# Altium schematic sheet top.SchDoc
size D; SheetNumber: 1; SheetTotal: 6
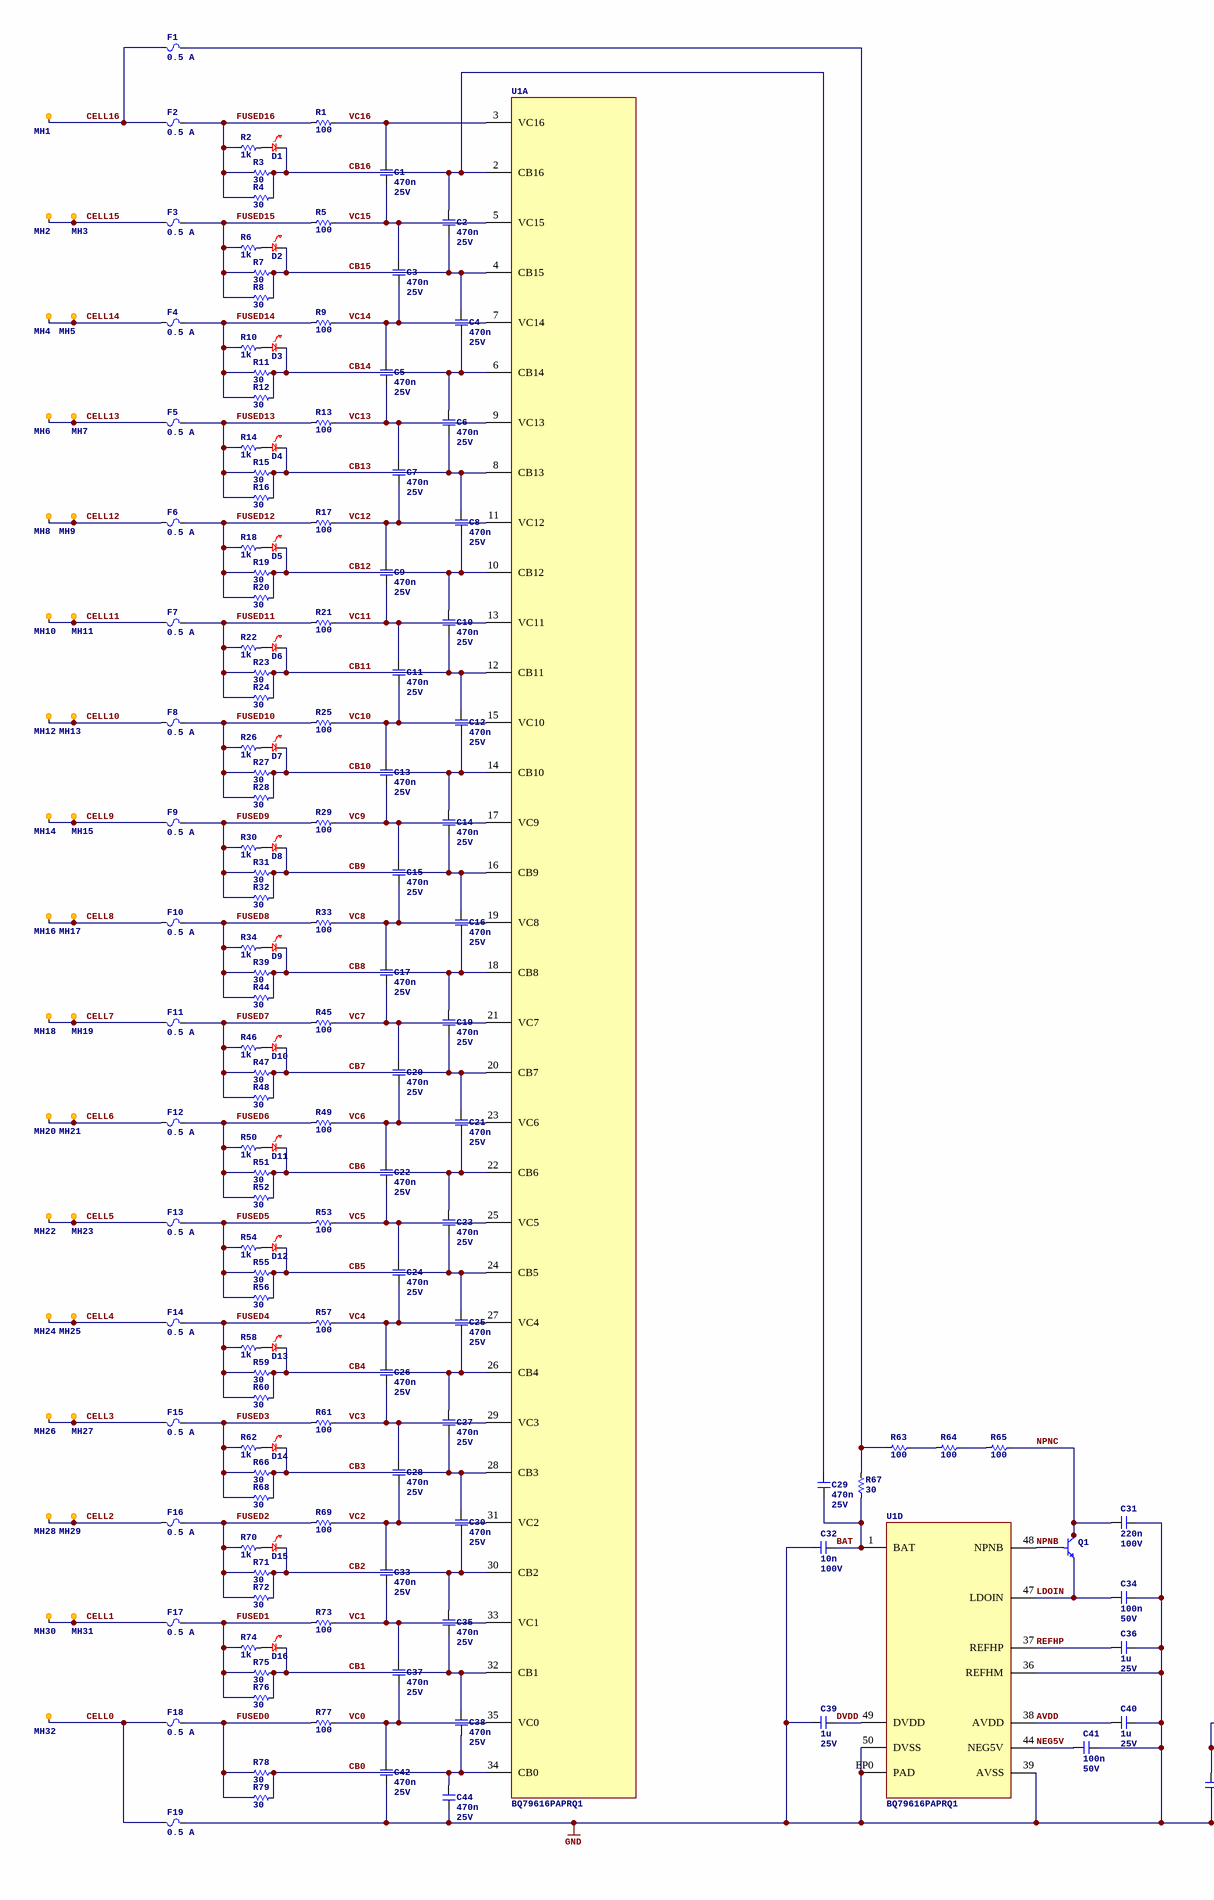
[diagram p0: top.SchDoc, left]
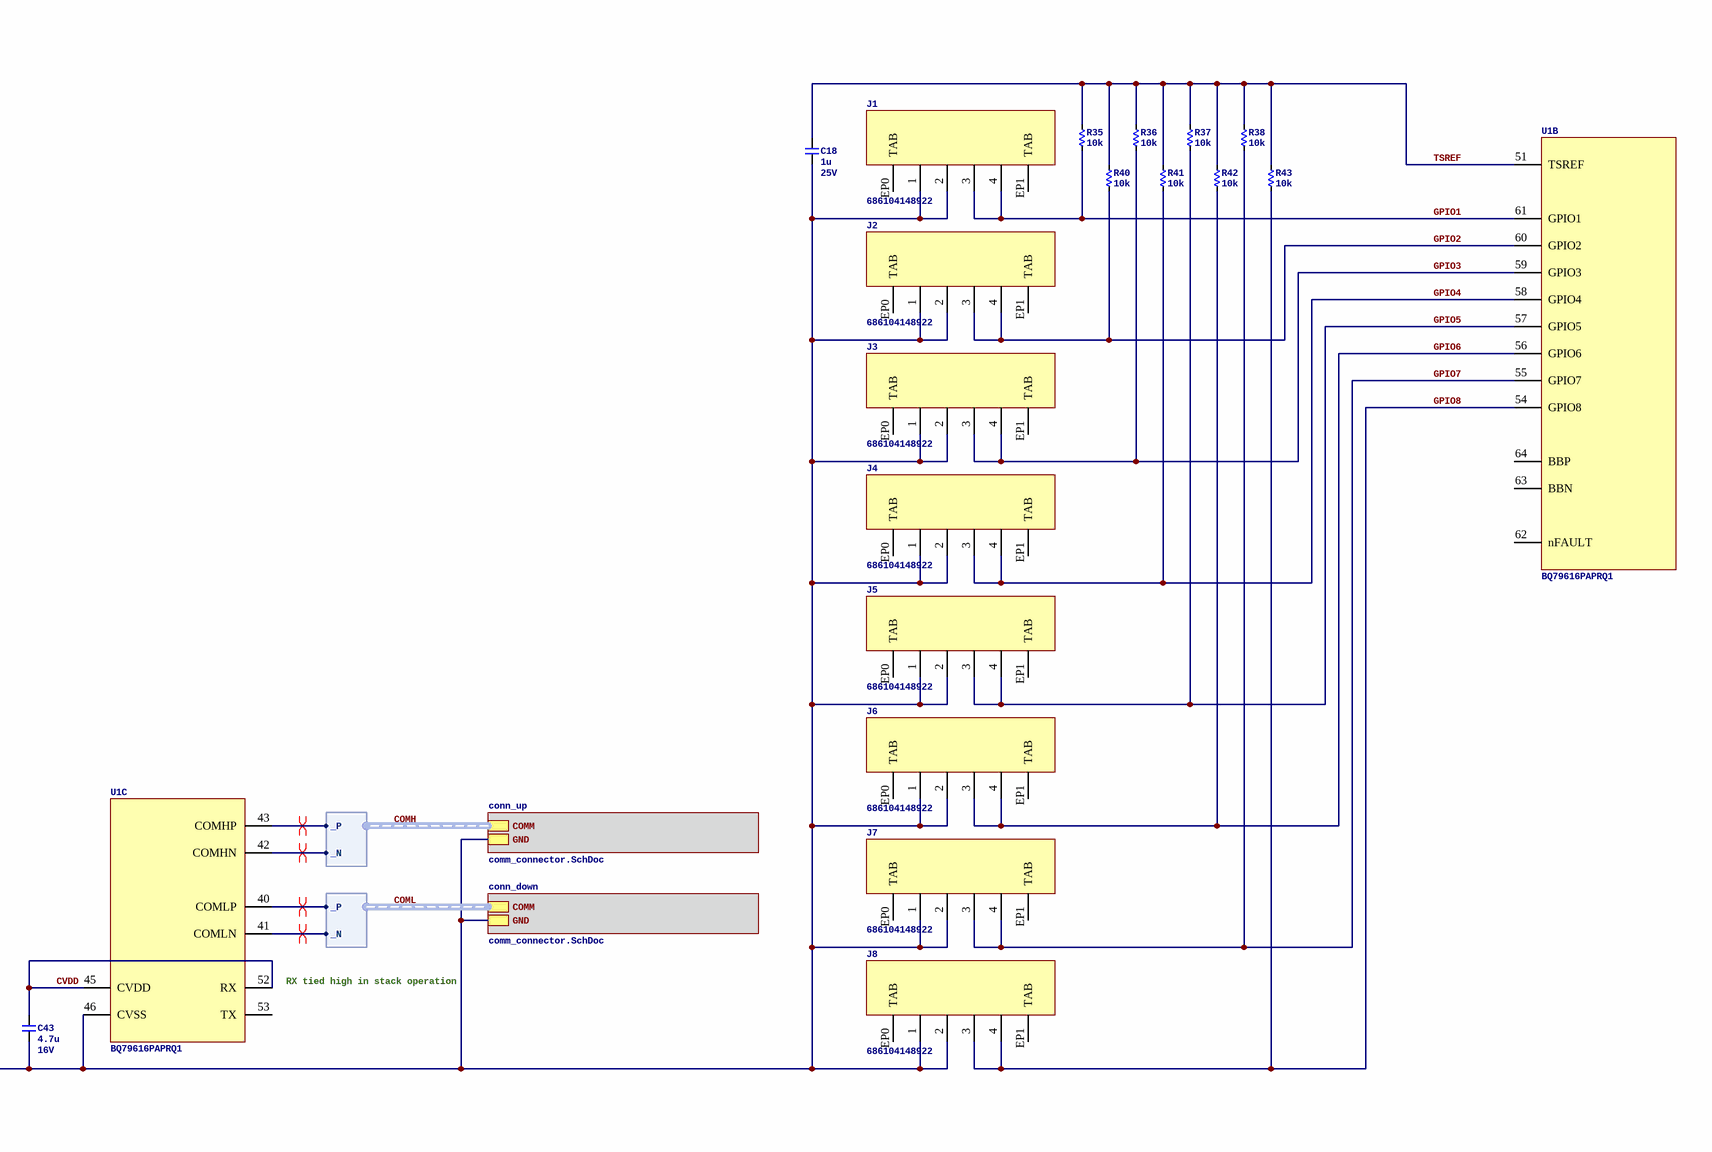
[diagram p1: top.SchDoc, right]

## Parts
C1  Capacitance: 470n  Voltage Rating: 25V  [C0603]  (hidden comment: CL10B474KA8NNNC)
C2  Capacitance: 470n  Voltage Rating: 25V  [C0603]  (hidden comment: CL10B474KA8NNNC)
C3  Capacitance: 470n  Voltage Rating: 25V  [C0603]  (hidden comment: CL10B474KA8NNNC)
C4  Capacitance: 470n  Voltage Rating: 25V  [C0603]  (hidden comment: CL10B474KA8NNNC)
C5  Capacitance: 470n  Voltage Rating: 25V  [C0603]  (hidden comment: CL10B474KA8NNNC)
C6  Capacitance: 470n  Voltage Rating: 25V  [C0603]  (hidden comment: CL10B474KA8NNNC)
C7  Capacitance: 470n  Voltage Rating: 25V  [C0603]  (hidden comment: CL10B474KA8NNNC)
C8  Capacitance: 470n  Voltage Rating: 25V  [C0603]  (hidden comment: CL10B474KA8NNNC)
C9  Capacitance: 470n  Voltage Rating: 25V  [C0603]  (hidden comment: CL10B474KA8NNNC)
C10  Capacitance: 470n  Voltage Rating: 25V  [C0603]  (hidden comment: CL10B474KA8NNNC)
C11  Capacitance: 470n  Voltage Rating: 25V  [C0603]  (hidden comment: CL10B474KA8NNNC)
C12  Capacitance: 470n  Voltage Rating: 25V  [C0603]  (hidden comment: CL10B474KA8NNNC)
C13  Capacitance: 470n  Voltage Rating: 25V  [C0603]  (hidden comment: CL10B474KA8NNNC)
C14  Capacitance: 470n  Voltage Rating: 25V  [C0603]  (hidden comment: CL10B474KA8NNNC)
C15  Capacitance: 470n  Voltage Rating: 25V  [C0603]  (hidden comment: CL10B474KA8NNNC)
C16  Capacitance: 470n  Voltage Rating: 25V  [C0603]  (hidden comment: CL10B474KA8NNNC)
C17  Capacitance: 470n  Voltage Rating: 25V  [C0603]  (hidden comment: CL10B474KA8NNNC)
C18  Capacitance: 1u  Voltage Rating: 25V  [C0603]  (hidden comment: CL10B105KA8NNNC)
C19  Capacitance: 470n  Voltage Rating: 25V  [C0603]  (hidden comment: CL10B474KA8NNNC)
C20  Capacitance: 470n  Voltage Rating: 25V  [C0603]  (hidden comment: CL10B474KA8NNNC)
C21  Capacitance: 470n  Voltage Rating: 25V  [C0603]  (hidden comment: CL10B474KA8NNNC)
C22  Capacitance: 470n  Voltage Rating: 25V  [C0603]  (hidden comment: CL10B474KA8NNNC)
C23  Capacitance: 470n  Voltage Rating: 25V  [C0603]  (hidden comment: CL10B474KA8NNNC)
C24  Capacitance: 470n  Voltage Rating: 25V  [C0603]  (hidden comment: CL10B474KA8NNNC)
C25  Capacitance: 470n  Voltage Rating: 25V  [C0603]  (hidden comment: CL10B474KA8NNNC)
C26  Capacitance: 470n  Voltage Rating: 25V  [C0603]  (hidden comment: CL10B474KA8NNNC)
C27  Capacitance: 470n  Voltage Rating: 25V  [C0603]  (hidden comment: CL10B474KA8NNNC)
C28  Capacitance: 470n  Voltage Rating: 25V  [C0603]  (hidden comment: CL10B474KA8NNNC)
C29  Capacitance: 470n  Voltage Rating: 25V  [C0603]  (hidden comment: CL10B474KA8NNNC)
C30  Capacitance: 470n  Voltage Rating: 25V  [C0603]  (hidden comment: CL10B474KA8NNNC)
C31  Capacitance: 220n  Voltage Rating: 100V  [C1206]  (hidden comment: TCC1206X7R224K101FT)
C32  Capacitance: 10n  Voltage Rating: 100V  [C0402]  (hidden comment: CC0402KRX7R0BB103)
C33  Capacitance: 470n  Voltage Rating: 25V  [C0603]  (hidden comment: CL10B474KA8NNNC)
C34  Capacitance: 100n  Voltage Rating: 50V  [C0402]  (hidden comment: CL05B104KB54PNC)
C35  Capacitance: 470n  Voltage Rating: 25V  [C0603]  (hidden comment: CL10B474KA8NNNC)
C36  Capacitance: 1u  Voltage Rating: 25V  [C0603]  (hidden comment: CL10B105KA8NNNC)
C37  Capacitance: 470n  Voltage Rating: 25V  [C0603]  (hidden comment: CL10B474KA8NNNC)
C38  Capacitance: 470n  Voltage Rating: 25V  [C0603]  (hidden comment: CL10B474KA8NNNC)
C39  Capacitance: 1u  Voltage Rating: 25V  [C0603]  (hidden comment: CL10B105KA8NNNC)
C40  Capacitance: 1u  Voltage Rating: 25V  [C0603]  (hidden comment: CL10B105KA8NNNC)
C41  Capacitance: 100n  Voltage Rating: 50V  [C0402]  (hidden comment: CL05B104KB54PNC)
C42  Capacitance: 470n  Voltage Rating: 25V  [C0603]  (hidden comment: CL10B474KA8NNNC)
C43  Capacitance: 4.7u  Voltage Rating: 16V  [C0805]  (hidden comment: CL21B475KOFNNNE)
C44  Capacitance: 470n  Voltage Rating: 25V  [C0603]  (hidden comment: CL10B474KA8NNNC)
D1  LTST-C190KRKT  [LED_0603P_RED]  (value not drawn)
D2  LTST-C190KRKT  [LED_0603P_RED]  (value not drawn)
D3  LTST-C190KRKT  [LED_0603P_RED]  (value not drawn)
D4  LTST-C190KRKT  [LED_0603P_RED]  (value not drawn)
D5  LTST-C190KRKT  [LED_0603P_RED]  (value not drawn)
D6  LTST-C190KRKT  [LED_0603P_RED]  (value not drawn)
D7  LTST-C190KRKT  [LED_0603P_RED]  (value not drawn)
D8  LTST-C190KRKT  [LED_0603P_RED]  (value not drawn)
D9  LTST-C190KRKT  [LED_0603P_RED]  (value not drawn)
D10  LTST-C190KRKT  [LED_0603P_RED]  (value not drawn)
D11  LTST-C190KRKT  [LED_0603P_RED]  (value not drawn)
D12  LTST-C190KRKT  [LED_0603P_RED]  (value not drawn)
D13  LTST-C190KRKT  [LED_0603P_RED]  (value not drawn)
D14  LTST-C190KRKT  [LED_0603P_RED]  (value not drawn)
D15  LTST-C190KRKT  [LED_0603P_RED]  (value not drawn)
D16  LTST-C190KRKT  [LED_0603P_RED]  (value not drawn)
F1  Current: 0.5 A  [JDTFUSE_JFC2410]  (hidden comment: JFC2410-0500TS)
F2  Current: 0.5 A  [JDTFUSE_JFC2410]  (hidden comment: JFC2410-0500TS)
F3  Current: 0.5 A  [JDTFUSE_JFC2410]  (hidden comment: JFC2410-0500TS)
F4  Current: 0.5 A  [JDTFUSE_JFC2410]  (hidden comment: JFC2410-0500TS)
F5  Current: 0.5 A  [JDTFUSE_JFC2410]  (hidden comment: JFC2410-0500TS)
F6  Current: 0.5 A  [JDTFUSE_JFC2410]  (hidden comment: JFC2410-0500TS)
F7  Current: 0.5 A  [JDTFUSE_JFC2410]  (hidden comment: JFC2410-0500TS)
F8  Current: 0.5 A  [JDTFUSE_JFC2410]  (hidden comment: JFC2410-0500TS)
F9  Current: 0.5 A  [JDTFUSE_JFC2410]  (hidden comment: JFC2410-0500TS)
F10  Current: 0.5 A  [JDTFUSE_JFC2410]  (hidden comment: JFC2410-0500TS)
F11  Current: 0.5 A  [JDTFUSE_JFC2410]  (hidden comment: JFC2410-0500TS)
F12  Current: 0.5 A  [JDTFUSE_JFC2410]  (hidden comment: JFC2410-0500TS)
F13  Current: 0.5 A  [JDTFUSE_JFC2410]  (hidden comment: JFC2410-0500TS)
F14  Current: 0.5 A  [JDTFUSE_JFC2410]  (hidden comment: JFC2410-0500TS)
F15  Current: 0.5 A  [JDTFUSE_JFC2410]  (hidden comment: JFC2410-0500TS)
F16  Current: 0.5 A  [JDTFUSE_JFC2410]  (hidden comment: JFC2410-0500TS)
F17  Current: 0.5 A  [JDTFUSE_JFC2410]  (hidden comment: JFC2410-0500TS)
F18  Current: 0.5 A  [JDTFUSE_JFC2410]  (hidden comment: JFC2410-0500TS)
F19  Current: 0.5 A  [JDTFUSE_JFC2410]  (hidden comment: JFC2410-0500TS)
J1  686104148922  [WURTH_WR-FPC_1.00mm_686104148922]
J2  686104148922  [WURTH_WR-FPC_1.00mm_686104148922]
J3  686104148922  [WURTH_WR-FPC_1.00mm_686104148922]
J4  686104148922  [WURTH_WR-FPC_1.00mm_686104148922]
J5  686104148922  [WURTH_WR-FPC_1.00mm_686104148922]
J6  686104148922  [WURTH_WR-FPC_1.00mm_686104148922]
J7  686104148922  [WURTH_WR-FPC_1.00mm_686104148922]
J8  686104148922  [WURTH_WR-FPC_1.00mm_686104148922]
MH1  HOLE  [HOLE_M2]  (value not drawn)  (no BOM)
MH2  HOLE  [HOLE_M2]  (value not drawn)  (no BOM)
MH3  HOLE  [HOLE_M2]  (value not drawn)  (no BOM)
MH4  HOLE  [HOLE_M2]  (value not drawn)  (no BOM)
MH5  HOLE  [HOLE_M2]  (value not drawn)  (no BOM)
MH6  HOLE  [HOLE_M2]  (value not drawn)  (no BOM)
MH7  HOLE  [HOLE_M2]  (value not drawn)  (no BOM)
MH8  HOLE  [HOLE_M2]  (value not drawn)  (no BOM)
MH9  HOLE  [HOLE_M2]  (value not drawn)  (no BOM)
MH10  HOLE  [HOLE_M2]  (value not drawn)  (no BOM)
MH11  HOLE  [HOLE_M2]  (value not drawn)  (no BOM)
MH12  HOLE  [HOLE_M2]  (value not drawn)  (no BOM)
MH13  HOLE  [HOLE_M2]  (value not drawn)  (no BOM)
MH14  HOLE  [HOLE_M2]  (value not drawn)  (no BOM)
MH15  HOLE  [HOLE_M2]  (value not drawn)  (no BOM)
MH16  HOLE  [HOLE_M2]  (value not drawn)  (no BOM)
MH17  HOLE  [HOLE_M2]  (value not drawn)  (no BOM)
MH18  HOLE  [HOLE_M2]  (value not drawn)  (no BOM)
MH19  HOLE  [HOLE_M2]  (value not drawn)  (no BOM)
MH20  HOLE  [HOLE_M2]  (value not drawn)  (no BOM)
MH21  HOLE  [HOLE_M2]  (value not drawn)  (no BOM)
MH22  HOLE  [HOLE_M2]  (value not drawn)  (no BOM)
MH23  HOLE  [HOLE_M2]  (value not drawn)  (no BOM)
MH24  HOLE  [HOLE_M2]  (value not drawn)  (no BOM)
MH25  HOLE  [HOLE_M2]  (value not drawn)  (no BOM)
MH26  HOLE  [HOLE_M2]  (value not drawn)  (no BOM)
MH27  HOLE  [HOLE_M2]  (value not drawn)  (no BOM)
MH28  HOLE  [HOLE_M2]  (value not drawn)  (no BOM)
MH29  HOLE  [HOLE_M2]  (value not drawn)  (no BOM)
MH30  HOLE  [HOLE_M2]  (value not drawn)  (no BOM)
MH31  HOLE  [HOLE_M2]  (value not drawn)  (no BOM)
MH32  HOLE  [HOLE_M2]  (value not drawn)  (no BOM)
Q1  NSV1C201MZ4T1G  [4SOT223]  (value not drawn)
R1  value 100  [R0402]  (hidden comment: RC0402FR-07100RL)
R2  value 1k  [R0402]  (hidden comment: 0402WGF1001TCE)
R3  value 30  [R2512]  (hidden comment: RC2512FK-0730RL)
R4  value 30  [R2512]  (hidden comment: RC2512FK-0730RL)
R5  value 100  [R0402]  (hidden comment: RC0402FR-07100RL)
R6  value 1k  [R0402]  (hidden comment: 0402WGF1001TCE)
R7  value 30  [R2512]  (hidden comment: RC2512FK-0730RL)
R8  value 30  [R2512]  (hidden comment: RC2512FK-0730RL)
R9  value 100  [R0402]  (hidden comment: RC0402FR-07100RL)
R10  value 1k  [R0402]  (hidden comment: 0402WGF1001TCE)
R11  value 30  [R2512]  (hidden comment: RC2512FK-0730RL)
R12  value 30  [R2512]  (hidden comment: RC2512FK-0730RL)
R13  value 100  [R0402]  (hidden comment: RC0402FR-07100RL)
R14  value 1k  [R0402]  (hidden comment: 0402WGF1001TCE)
R15  value 30  [R2512]  (hidden comment: RC2512FK-0730RL)
R16  value 30  [R2512]  (hidden comment: RC2512FK-0730RL)
R17  value 100  [R0402]  (hidden comment: RC0402FR-07100RL)
R18  value 1k  [R0402]  (hidden comment: 0402WGF1001TCE)
R19  value 30  [R2512]  (hidden comment: RC2512FK-0730RL)
R20  value 30  [R2512]  (hidden comment: RC2512FK-0730RL)
R21  value 100  [R0402]  (hidden comment: RC0402FR-07100RL)
R22  value 1k  [R0402]  (hidden comment: 0402WGF1001TCE)
R23  value 30  [R2512]  (hidden comment: RC2512FK-0730RL)
R24  value 30  [R2512]  (hidden comment: RC2512FK-0730RL)
R25  value 100  [R0402]  (hidden comment: RC0402FR-07100RL)
R26  value 1k  [R0402]  (hidden comment: 0402WGF1001TCE)
R27  value 30  [R2512]  (hidden comment: RC2512FK-0730RL)
R28  value 30  [R2512]  (hidden comment: RC2512FK-0730RL)
R29  value 100  [R0402]  (hidden comment: RC0402FR-07100RL)
R30  value 1k  [R0402]  (hidden comment: 0402WGF1001TCE)
R31  value 30  [R2512]  (hidden comment: RC2512FK-0730RL)
R32  value 30  [R2512]  (hidden comment: RC2512FK-0730RL)
R33  value 100  [R0402]  (hidden comment: RC0402FR-07100RL)
R34  value 1k  [R0402]  (hidden comment: 0402WGF1001TCE)
R35  value 10k  [R0402]  (hidden comment: 0402WGF1002TCE)
R36  value 10k  [R0402]  (hidden comment: 0402WGF1002TCE)
R37  value 10k  [R0402]  (hidden comment: 0402WGF1002TCE)
R38  value 10k  [R0402]  (hidden comment: 0402WGF1002TCE)
R39  value 30  [R2512]  (hidden comment: RC2512FK-0730RL)
R40  value 10k  [R0402]  (hidden comment: 0402WGF1002TCE)
R41  value 10k  [R0402]  (hidden comment: 0402WGF1002TCE)
R42  value 10k  [R0402]  (hidden comment: 0402WGF1002TCE)
R43  value 10k  [R0402]  (hidden comment: 0402WGF1002TCE)
R44  value 30  [R2512]  (hidden comment: RC2512FK-0730RL)
R45  value 100  [R0402]  (hidden comment: RC0402FR-07100RL)
R46  value 1k  [R0402]  (hidden comment: 0402WGF1001TCE)
R47  value 30  [R2512]  (hidden comment: RC2512FK-0730RL)
R48  value 30  [R2512]  (hidden comment: RC2512FK-0730RL)
R49  value 100  [R0402]  (hidden comment: RC0402FR-07100RL)
R50  value 1k  [R0402]  (hidden comment: 0402WGF1001TCE)
R51  value 30  [R2512]  (hidden comment: RC2512FK-0730RL)
R52  value 30  [R2512]  (hidden comment: RC2512FK-0730RL)
R53  value 100  [R0402]  (hidden comment: RC0402FR-07100RL)
R54  value 1k  [R0402]  (hidden comment: 0402WGF1001TCE)
R55  value 30  [R2512]  (hidden comment: RC2512FK-0730RL)
R56  value 30  [R2512]  (hidden comment: RC2512FK-0730RL)
R57  value 100  [R0402]  (hidden comment: RC0402FR-07100RL)
R58  value 1k  [R0402]  (hidden comment: 0402WGF1001TCE)
R59  value 30  [R2512]  (hidden comment: RC2512FK-0730RL)
R60  value 30  [R2512]  (hidden comment: RC2512FK-0730RL)
R61  value 100  [R0402]  (hidden comment: RC0402FR-07100RL)
R62  value 1k  [R0402]  (hidden comment: 0402WGF1001TCE)
R63  value 100  [R0402]  (hidden comment: RC0402FR-07100RL)
R64  value 100  [R0402]  (hidden comment: RC0402FR-07100RL)
R65  value 100  [R0402]  (hidden comment: RC0402FR-07100RL)
R66  value 30  [R2512]  (hidden comment: RC2512FK-0730RL)
R67  value 30  [R0402]  (hidden comment: RC0402FR-0730RL)
R68  value 30  [R2512]  (hidden comment: RC2512FK-0730RL)
R69  value 100  [R0402]  (hidden comment: RC0402FR-07100RL)
R70  value 1k  [R0402]  (hidden comment: 0402WGF1001TCE)
R71  value 30  [R2512]  (hidden comment: RC2512FK-0730RL)
R72  value 30  [R2512]  (hidden comment: RC2512FK-0730RL)
R73  value 100  [R0402]  (hidden comment: RC0402FR-07100RL)
R74  value 1k  [R0402]  (hidden comment: 0402WGF1001TCE)
R75  value 30  [R2512]  (hidden comment: RC2512FK-0730RL)
R76  value 30  [R2512]  (hidden comment: RC2512FK-0730RL)
R77  value 100  [R0402]  (hidden comment: RC0402FR-07100RL)
R78  value 30  [R2512]  (hidden comment: RC2512FK-0730RL)
R79  value 30  [R2512]  (hidden comment: RC2512FK-0730RL)
U1  BQ79616PAPRQ1  [TI_PAP0064F]  (parts A,B,C,D of 4)

## Sub-sheets
conn_down = comm_connector.SchDoc: COMM (harness DIFF), GND
conn_up = comm_connector.SchDoc: COMM (harness DIFF), GND

## Harnesses
DIFF: _P, _N

## Nets
GND: C18.2 C31.2 C32.2 C34.2 C36.2 C39.2 C40.2 C41.2 C42.2 C43.2 C44.2 F19.2 J1.1 J1.2 J2.1 J2.2 J3.1 J3.2 J4.1 J4.2 J5.1 J5.2 J6.1 J6.2 J7.1 J7.2 J8.1 J8.2 U1.36(REFHM) U1.39(AVSS) U1.46(CVSS) U1.50(DVSS) U1.EP0(PAD) ; sheet conn_up/GND, sheet conn_down/GND
AVDD: C40.1 U1.38(AVDD)
BAT: C29.2 C32.1 R67.2 U1.1(BAT)
CB0: C38.2 C44.1 R78.1 R79.2 U1.34(CB0)
CB1: C35.2 C38.1 D16.1 R75.1 R76.2 U1.32(CB1)
CB2: C30.2 C35.1 D15.1 R71.1 R72.2 U1.30(CB2)
CB3: C27.2 C30.1 D14.1 R66.1 R68.2 U1.28(CB3)
CB4: C25.2 C27.1 D13.1 R59.1 R60.2 U1.26(CB4)
CB5: C23.2 C25.1 D12.1 R55.1 R56.2 U1.24(CB5)
CB6: C21.2 C23.1 D11.1 R51.1 R52.2 U1.22(CB6)
CB7: C19.2 C21.1 D10.1 R47.1 R48.2 U1.20(CB7)
CB8: C16.2 C19.1 D9.1 R39.1 R44.2 U1.18(CB8)
CB9: C14.2 C16.1 D8.1 R31.1 R32.2 U1.16(CB9)
CB10: C12.2 C14.1 D7.1 R27.1 R28.2 U1.14(CB10)
CB11: C10.2 C12.1 D6.1 R23.1 R24.2 U1.12(CB11)
CB12: C8.2 C10.1 D5.1 R19.1 R20.2 U1.10(CB12)
CB13: C6.2 C8.1 D4.1 R15.1 R16.2 U1.8(CB13)
CB14: C4.2 C6.1 D3.1 R11.1 R12.2 U1.6(CB14)
CB15: C2.2 C4.1 D2.1 R7.1 R8.2 U1.4(CB15)
CB16: C2.1 C29.1 D1.1 R3.1 R4.2 U1.2(CB16)
CELL0: F18.1 F19.1 MH32.1
CELL1: F17.1 MH30.1 MH31.1
CELL2: F16.1 MH28.1 MH29.1
CELL3: F15.1 MH26.1 MH27.1
CELL4: F14.1 MH24.1 MH25.1
CELL5: F13.1 MH22.1 MH23.1
CELL6: F12.1 MH20.1 MH21.1
CELL7: F11.1 MH18.1 MH19.1
CELL8: F10.1 MH16.1 MH17.1
CELL9: F9.1 MH14.1 MH15.1
CELL10: F8.1 MH12.1 MH13.1
CELL11: F7.1 MH10.1 MH11.1
CELL12: F6.1 MH8.1 MH9.1
CELL13: F5.1 MH6.1 MH7.1
CELL14: F4.1 MH4.1 MH5.1
CELL15: F3.1 MH2.1 MH3.1
CELL16: F1.1 F2.1 MH1.1
COMH._N: U1.42(COMHN) ; sheet conn_up/COMM._N
COMH._P: U1.43(COMHP) ; sheet conn_up/COMM._P
COML._N: U1.41(COMLN) ; sheet conn_down/COMM._N
COML._P: U1.40(COMLP) ; sheet conn_down/COMM._P
CVDD: C43.1 U1.45(CVDD) U1.52(RX)
DVDD: C39.1 U1.49(DVDD)
FUSED0: F18.2 R77.1 R78.2 R79.1
FUSED1: F17.2 R73.1 R74.1 R75.2 R76.1
FUSED2: F16.2 R69.1 R70.1 R71.2 R72.1
FUSED3: F15.2 R61.1 R62.1 R66.2 R68.1
FUSED4: F14.2 R57.1 R58.1 R59.2 R60.1
FUSED5: F13.2 R53.1 R54.1 R55.2 R56.1
FUSED6: F12.2 R49.1 R50.1 R51.2 R52.1
FUSED7: F11.2 R45.1 R46.1 R47.2 R48.1
FUSED8: F10.2 R33.1 R34.1 R39.2 R44.1
FUSED9: F9.2 R29.1 R30.1 R31.2 R32.1
FUSED10: F8.2 R25.1 R26.1 R27.2 R28.1
FUSED11: F7.2 R21.1 R22.1 R23.2 R24.1
FUSED12: F6.2 R17.1 R18.1 R19.2 R20.1
FUSED13: F5.2 R13.1 R14.1 R15.2 R16.1
FUSED14: F4.2 R9.1 R10.1 R11.2 R12.1
FUSED15: F3.2 R5.1 R6.1 R7.2 R8.1
FUSED16: F2.2 R1.1 R2.1 R3.2 R4.1
GPIO1: J1.3 J1.4 R35.2 U1.61(GPIO1)
GPIO2: J2.3 J2.4 R40.2 U1.60(GPIO2)
GPIO3: J3.3 J3.4 R36.2 U1.59(GPIO3)
GPIO4: J4.3 J4.4 R41.2 U1.58(GPIO4)
GPIO5: J5.3 J5.4 R37.2 U1.57(GPIO5)
GPIO6: J6.3 J6.4 R42.2 U1.56(GPIO6)
GPIO7: J7.3 J7.4 R38.2 U1.55(GPIO7)
GPIO8: J8.3 J8.4 R43.2 U1.54(GPIO8)
LDOIN: C34.1 Q1.3(E) U1.47(LDOIN)
NEG5V: C41.1 U1.44(NEG5V)
NPNB: Q1.1(B) U1.48(NPNB)
NPNC: C31.1 Q1.2(C) Q1.4(C) R65.1
REFHP: C36.1 U1.37(REFHP)
TSREF: C18.1 R35.1 R36.1 R37.1 R38.1 R40.1 R41.1 R42.1 R43.1 U1.51(TSREF)
VC0: C37.2 C42.1 R77.2 U1.35(VC0)
VC1: C33.2 C37.1 R73.2 U1.33(VC1)
VC2: C28.2 C33.1 R69.2 U1.31(VC2)
VC3: C26.2 C28.1 R61.2 U1.29(VC3)
VC4: C24.2 C26.1 R57.2 U1.27(VC4)
VC5: C22.2 C24.1 R53.2 U1.25(VC5)
VC6: C20.2 C22.1 R49.2 U1.23(VC6)
VC7: C17.2 C20.1 R45.2 U1.21(VC7)
VC8: C15.2 C17.1 R33.2 U1.19(VC8)
VC9: C13.2 C15.1 R29.2 U1.17(VC9)
VC10: C11.2 C13.1 R25.2 U1.15(VC10)
VC11: C9.2 C11.1 R21.2 U1.13(VC11)
VC12: C7.2 C9.1 R17.2 U1.11(VC12)
VC13: C5.2 C7.1 R13.2 U1.9(VC13)
VC14: C3.2 C5.1 R9.2 U1.7(VC14)
VC15: C1.2 C3.1 R5.2 U1.5(VC15)
VC16: C1.1 R1.2 U1.3(VC16)
NetD1_2: D1.2 R2.2
NetD2_2: D2.2 R6.2
NetD3_2: D3.2 R10.2
NetD4_2: D4.2 R14.2
NetD5_2: D5.2 R18.2
NetD6_2: D6.2 R22.2
NetD7_2: D7.2 R26.2
NetD8_2: D8.2 R30.2
NetD9_2: D9.2 R34.2
NetD10_2: D10.2 R46.2
NetD11_2: D11.2 R50.2
NetD12_2: D12.2 R54.2
NetD13_2: D13.2 R58.2
NetD14_2: D14.2 R62.2
NetD15_2: D15.2 R70.2
NetD16_2: D16.2 R74.2
NetF1_2: F1.2 R63.2 R67.1
NetR63_1: R63.1 R64.2
NetR64_1: R64.1 R65.2

Not connected (* = marked no-connect by the designer): J1 EP0(TAB) EP1(TAB); J2 EP0(TAB) EP1(TAB); J3 EP0(TAB) EP1(TAB); J4 EP0(TAB) EP1(TAB); J5 EP0(TAB) EP1(TAB); J6 EP0(TAB) EP1(TAB); J7 EP0(TAB) EP1(TAB); J8 EP0(TAB) EP1(TAB); U1 53(TX) 62(nFAULT) 63(BBN) 64(BBP)

## Buses and harness runs
harness COMH = sheet conn_up/COMM
harness COML = sheet conn_down/COMM

## Layout directives
differential pair; differential pair class DE_100: COMH._N, COMH._P, COML._N, COML._P

## Notes on the sheet
- (near U1) RX tied high in stack operation

## Library data of the parts
C1-C17 C19-C30 C33 C35 C37 C38 C42 C44 = CL10B474KA8NNNC: Manufacturer: Samsung Electro-Mechanics; Dielectric: X7R; Manufacturer Part Number: CL10B474KA8NNNC; ComponentLink1URL: https://wmsc.lcsc.com/wmsc/upload/file/pdf/v2/lcsc/2304140030_Samsung-Electro-Mechanics-CL10B474KA8NNNC_C1623.pdf; ComponentLink1Description: Datasheet; Package: 0603; Supplier 2: LCSC; Supplier Part Number 2: C1623
C18 C36 C39 C40 = CL10B105KA8NNNC: Manufacturer: Samsung Electro-Mechanics; Dielectric: X7R; Manufacturer Part Number: CL10B105KA8NNNC; ComponentLink1URL: https://wmsc.lcsc.com/wmsc/upload/file/pdf/v2/lcsc/2304140030_Samsung-Electro-Mechanics-CL10B105KA8NNNC_C29936.pdf; ComponentLink1Description: Datasheet; Package: 0603; Supplier 2: LCSC; Supplier Part Number 2: C29936
C31 = TCC1206X7R224K101FT: Manufacturer: CCTC; Dielectric: X7R; Manufacturer Part Number: TCC1206X7R224K101FT; ComponentLink1URL: https://wmsc.lcsc.com/wmsc/upload/file/pdf/v2/lcsc/2304140030_CCTC-TCC1206X7R224K101FT_C374077.pdf; ComponentLink1Description: Datasheet; Package: 1206; Supplier 2: LCSC; Supplier Part Number 2: C374077
C32 = CC0402KRX7R0BB103: Manufacturer: YAGEO; Dielectric: X7R; Manufacturer Part Number: CC0402KRX7R0BB103; ComponentLink1URL: https://wmsc.lcsc.com/wmsc/upload/file/pdf/v2/lcsc/2007171235_YAGEO-CC0402KRX7R0BB103_C527014.pdf; ComponentLink1Description: Datasheet; Package: 0402; Supplier 2: LCSC; Supplier Part Number 2: C527014
C34 C41 = CL05B104KB54PNC: Manufacturer: Samsung Electro-Mechanics; Dielectric: X7R; ComponentLink1URL: https://wmsc.lcsc.com/wmsc/upload/file/pdf/v2/lcsc/2304140030_Samsung-Electro-Mechanics-CL05B104KB54PNC_C307331.pdf; ComponentLink1Description: Datasheet; Manufacturer Part Number: CL05B104KB54PNC; Package: 0402; Supplier 2: LCSC; Supplier Part Number 2: C307331
C43 = CL21B475KOFNNNE: Manufacturer: Samsung Electro-Mechanics; Dielectric: X7R; Manufacturer Part Number: CL21B475KOFNNNE; ComponentLink1URL: https://wmsc.lcsc.com/wmsc/upload/file/pdf/v2/lcsc/2304140030_Samsung-Electro-Mechanics-CL21B475KOFNNNE_C107365.pdf; ComponentLink1Description: Datasheet; Package: 0805; Supplier 2: LCSC; Supplier Part Number 2: C107365
D1-D16 = LED_0603_RED_LTST-C190KRKT: LED SUPER RED CLEAR 0603 SMD; Manufacturer: Lite-On Inc; ComponentLink1URL: https://optoelectronics.liteon.com/upload/download/DS-22-99-0151/LTST-C190KRKT.pdf; ComponentLink1Description: Datasheet; Supplier 1: Digikey; Supplier Part Number 1: 160-1436-1-ND; Manufacturer Part Number: LTST-C190KRKT; Supplier 2: LCSC; Supplier Part Number 2: C94869
F1-F19 = FUSE_SLOW_0.5A_JFC2410-0500TS: FUSE 0.5A 250V SMD; Manufacturer: Shenzhen JDTfuse; Supplier 1: LCSC; Supplier Part Number 1: C136377; Manufacturer Part Number: JFC2410-0500TS; ComponentLink1Description: Datasheet; ComponentLink1URL: https://www.lcsc.com/datasheet/C136377.pdf
J1-J8 = CONN_WURTH_WR-FPC_4POS_1.00mm_686104148922: WR-FPC 1mm SMT Horiz. Bot. Contact Hinge type; Manufacturer: Wurth Elektronik; Supplier 1: Digikey; Supplier Part Number 1: 732-6016-1-ND; Manufacturer Part Number: 686104148922; Supplier 2: Mouser; Supplier Part Number 2: 710-686104148922; ComponentLink1Description: Drawing; ComponentLink1URL: https://www.we-online.com/components/products/datasheet/686104148922.pdf
Q1 = NPN_100V_NSV1C201MZ4T1G: Small Signal Bipolar Transistor, 2A I(C), 100V V(BR)CEO, 1-Element, NPN, Silicon, TO-261AA; Manufacturer: ON Semiconductor; Supplier 1: Digikey; Supplier Part Number 1: NSV1C201MZ4T1GOSCT-ND; Manufacturer Part Number: NSV1C201MZ4T1G; ComponentLink1Description: Datasheet; ComponentLink1URL: https://www.onsemi.com/pdf/datasheet/nss1c201mz4-d.pdf; Supplier 2: LCSC; Supplier Part Number 2: C86644
R1 R5 R9 R13 R17 R21 R25 R29 R33 R45 R49 R53 R57 R61 R63-R65 R69 R73 R77 = RC0402FR-07100RL: Manufacturer: YAGEO; Tolerance: 1%; Temperature Coefficient: Â±100ppm/â„ƒ; Power Rating (mW): 62.5; Manufacturer Part Number: RC0402FR-07100RL; ComponentLink1Description: Datasheet; ComponentLink1URL: https://wmsc.lcsc.com/wmsc/upload/file/pdf/v2/lcsc/2304140030_YAGEO-RC0402FR-07100RL_C106232.pdf; Package: 0402; Supplier 2: LCSC; Supplier Part Number 2: C106232
R2 R6 R10 R14 R18 R22 R26 R30 R34 R46 R50 R54 R58 R62 R70 R74 = 0402WGF1001TCE: Manufacturer: UNI-ROYAL(Uniroyal Elec); Tolerance: 1%; Temperature Coefficient: Â±100ppm/â„ƒ; Power Rating (mW): 62.5; ComponentLink1Description: Datasheet; ComponentLink1URL: https://wmsc.lcsc.com/wmsc/upload/file/pdf/v2/lcsc/2206010216_UNI-ROYAL-Uniroyal-Elec-0402WGF1001TCE_C11702.pdf; Manufacturer Part Number: 0402WGF1001TCE; Package: 0402; Supplier 2: LCSC; Supplier Part Number 2: C11702
R3 R4 R7 R8 R11 R12 R15 R16 R19 R20 R23 R24 R27 R28 R31 R32 R39 R44 R47 R48 R51 R52 R55 R56 R59 R60 R66 R68 R71 R72 R75 R76 R78 R79 = RC2512FK-0730RL: Manufacturer: YAGEO; Tolerance: 1%; Temperature Coefficient: Â±100ppm/â„ƒ; Power Rating (mW): 1000; Manufacturer Part Number: RC2512FK-0730RL; ComponentLink1Description: Datasheet; ComponentLink1URL: https://wmsc.lcsc.com/wmsc/upload/file/pdf/v2/lcsc/2304140030_YAGEO-RC2512FK-0730RL_C309607.pdf; Package: 2512; Supplier 2: LCSC; Supplier Part Number 2: C309607
R35-R38 R40-R43 = 0402WGF1002TCE: Manufacturer: UNI-ROYAL(Uniroyal Elec); Tolerance: 1%; Temperature Coefficient: Â±100ppm/â„ƒ; Power Rating (mW): 62.5; ComponentLink1Description: Datasheet; ComponentLink1URL: https://wmsc.lcsc.com/wmsc/upload/file/pdf/v2/lcsc/2206010100_UNI-ROYAL-Uniroyal-Elec-0402WGF1002TCE_C25744.pdf; Manufacturer Part Number: 0402WGF1002TCE; Package: 0402; Supplier 2: LCSC; Supplier Part Number 2: C25744
R67 = RC0402FR-0730RL: Manufacturer: YAGEO; Tolerance: 1%; Temperature Coefficient: Â±100ppm/â„ƒ; Power Rating (mW): 62.5; Manufacturer Part Number: RC0402FR-0730RL; ComponentLink1Description: Datasheet; ComponentLink1URL: https://wmsc.lcsc.com/wmsc/upload/file/pdf/v2/lcsc/2304140030_YAGEO-RC0402FR-0730RL_C138007.pdf; Package: 0402; Supplier 2: LCSC; Supplier Part Number 2: C138007
U1 = MONITOR_BQ79616PAPRQ1: IC MONITOR BATT STACK; Manufacturer: Texas Instruments; Manufacturer Part Number: BQ79616PAPRQ1; Supplier Part Number 2: C3682338; Supplier 2: LCSC; Supplier 1: Digikey; Supplier Part Number 1: 296-BQ79616PAPRQ1CT-ND; ComponentLink1Description: Datasheet; ComponentLink1URL: https://www.ti.com/lit/ds/symlink/bq79616-q1.pdf